# EAGLE design Gyro_revb (EAGLE 7.7.0)
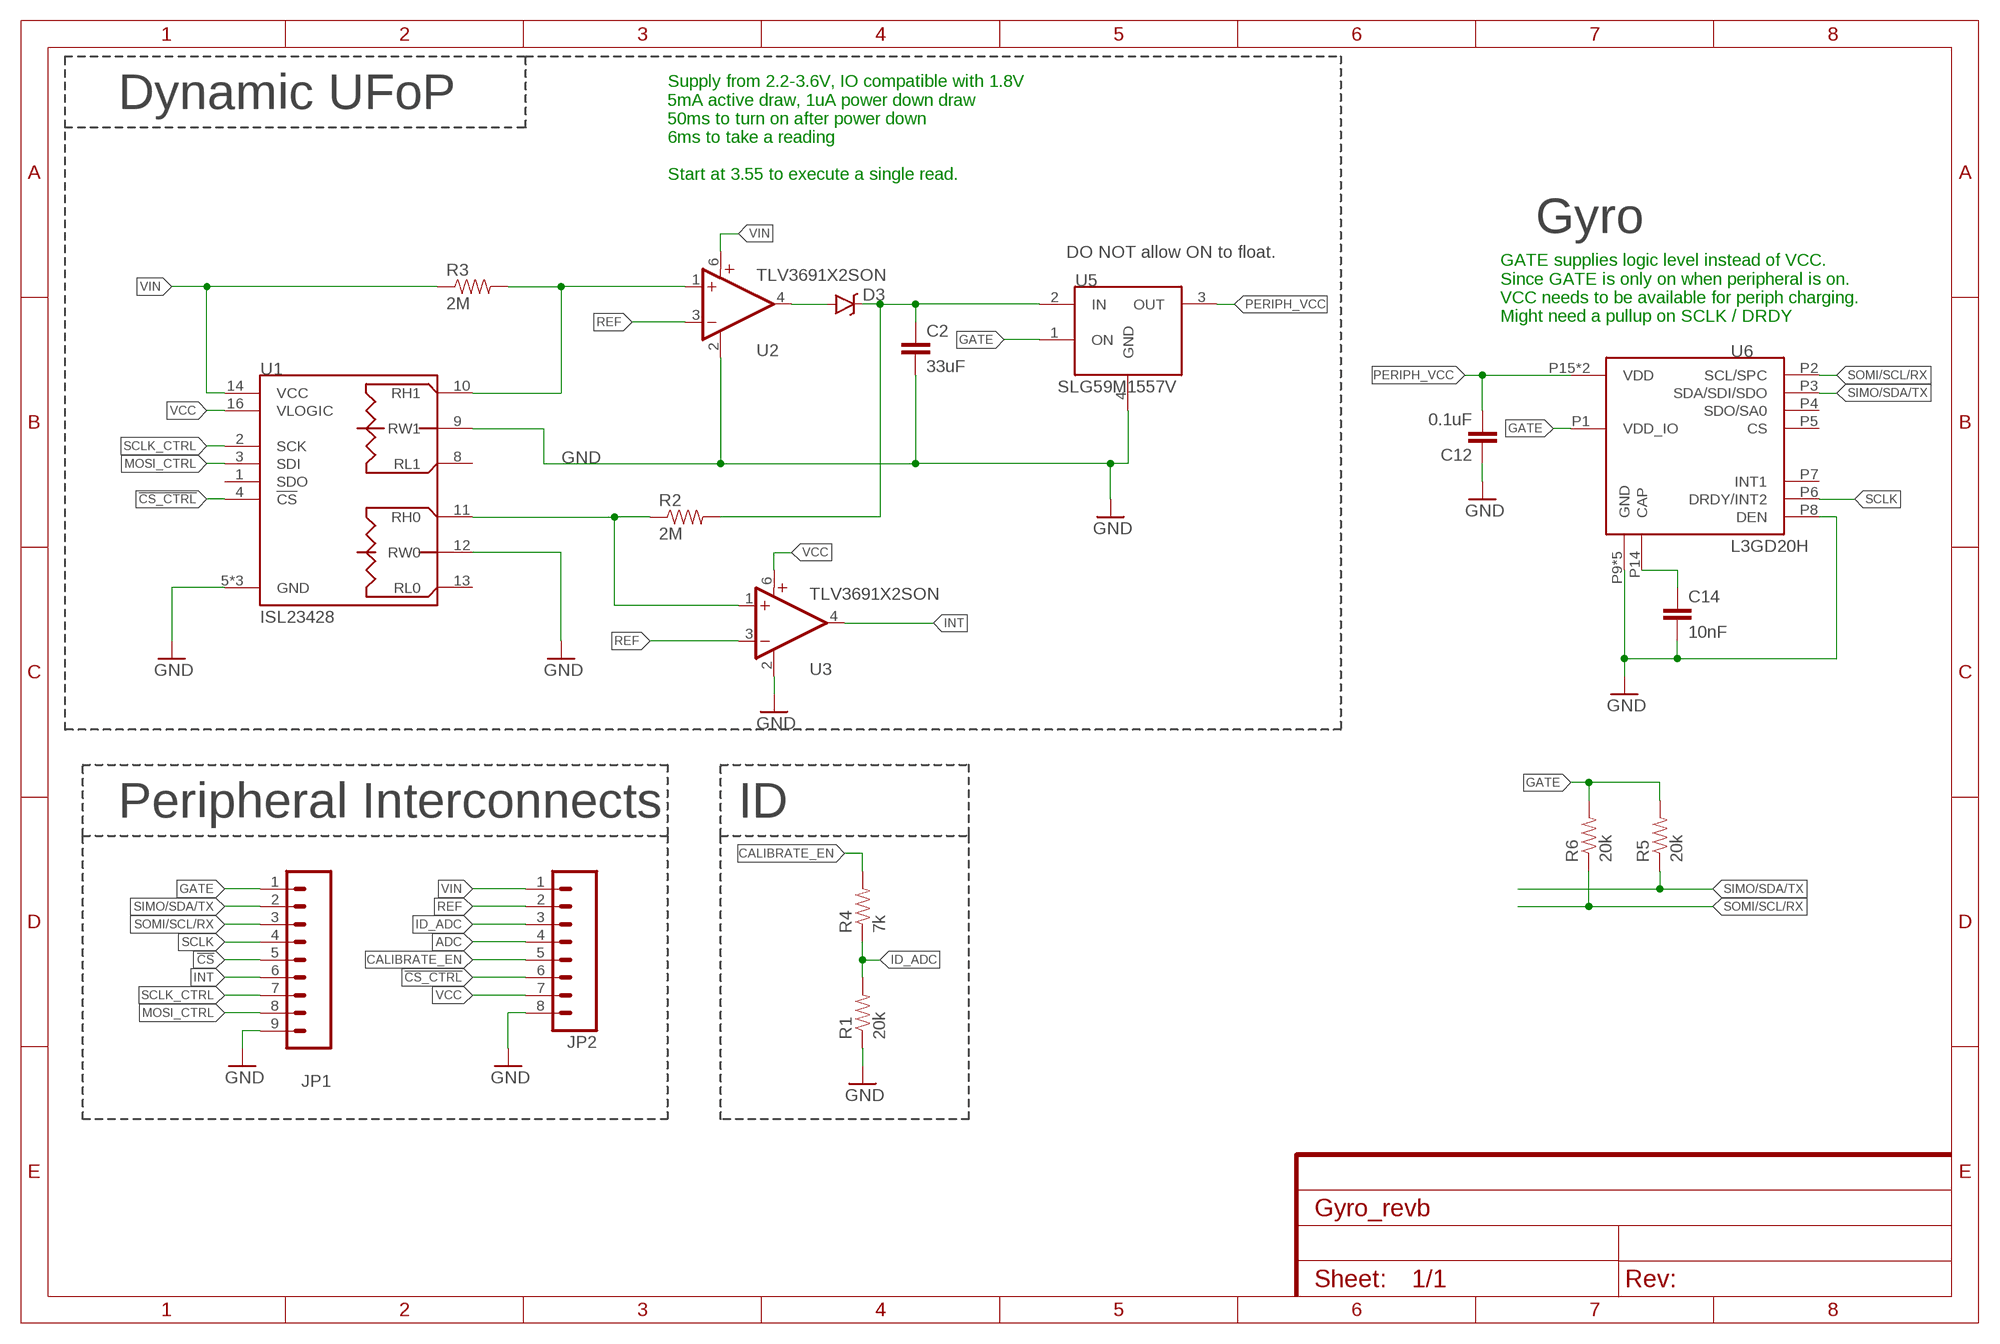
[diagram p0: schematic, sheet 1]
FRAME2 (FRAME-A4L): CNAME: Gyro Peripheral; CREVISION: B; DESIGNER: Josiah Hester

## Parts
C2  33uF  CAP1206  [1206]
C12  0.1uF  C-EU  [0402]
C14  10nF  C-EU  [0402]
D3  RB751  DIODE-SCHOTTKY-RB751  [SOD-523]
JP1  M091.27MM  [1X09-1.27MM]
JP2  M081.27MM  [1X08-1.27MM]
R1  20k  R-EU  [0402]
R2  2M  R-EU  [0402]
R3  2M  R-EU  [0402]
R4  7k  R-EU  [0402]
R5  20k  R-EU  [0402]
R6  20k  R-EU  [0402]
U1  ISL23428  [UTQFN-16]
U2  TLV3691X2SON  [X2SON]
U3  TLV3691X2SON  [X2SON]
U5  SLG59M1557V  [4STDFN]
U6  L3GD20H  [LGA16L]

## Nets
!CS: JP1.5
!CS_CTRL: JP2.6 U1.4(!CS)
ADC: JP2.4
CALIBRATE_EN: JP2.5 R4.2
GATE: JP1.1 R5.2 R6.2 U5.1(ON) U6.P1(VDD_IO)
GND: C2.2 C12.1 C14.2 JP1.9 JP2.8 R1.1 U1.5(GND) U1.6(GND) U1.9(RW1) U1.12(RW0) U1.15(GND) U2.2(GND) U3.2(GND) U5.4(GND) U6.P8(DEN) U6.P9(GND) U6.P10(GND) U6.P11(GND) U6.P12(GND) U6.P13(GND)
ID_ADC: JP2.3 R1.2 R4.1
INT: JP1.6 U3.4(OUT)
MOSI_CTRL: JP1.8 U1.3(SDI)
N$1: D3.A U2.4(OUT)
N$2: C2.1 D3.C R2.2 U5.2(IN)
N$4: R3.2 U1.10(RH1) U2.1(+IN)
N$5: R2.1 U1.11(RH0) U3.1(+IN)
N$8: C14.1 U6.P14(CAP)
PERIPH_VCC: C12.2 U5.3(OUT) U6.P15(VDD) U6.P16(VDD)
REF: JP2.2 U2.3(-IN) U3.3(-IN)
SCLK: JP1.4 U6.P6(DRDY/INT2)
SCLK_CTRL: JP1.7 U1.2(SCK)
SIMO/SDA/TX: JP1.2 R5.1 U6.P3(SDA/SDI/SDO)
SOMI/SCL/RX: JP1.3 R6.1 U6.P2(SCL/SPC)
VCC: JP2.7 U1.16(VLOGIC) U3.6(V+)
VIN: JP2.1 R3.1 U1.14(VCC) U2.6(V+)
Unconnected: U1.1(SDO) U1.8(RL1) U1.13(RL0) U6.P4(SDO/SA0) U6.P5(CS) U6.P7(INT1)

## Notes on the sheet
- Dynamic UFoP
- Supply from 2.2-3.6V, IO compatible with 1.8V
  5mA active draw, 1uA power down draw
  50ms to turn on after power down
  6ms to take a reading
  
  Start at 3.55 to execute a single read.
- Gyro
- DO NOT allow ON to float.
- GATE supplies logic level instead of VCC.
  Since GATE is only on when peripheral is on.
  VCC needs to be available for periph charging.
  Might need a pullup on SCLK / DRDY
- Peripheral Interconnects | ID

## Library data of the parts
C2 = SparkFun-Capacitors:CAP: Capacitor Standard 0603 ceramic capacitor, and 0.1" leaded capacitor.; DIGIKEY: 445-4060-1-ND; MPN: C3216X5R0J336M130AC
C12 = tiny_passives:C-EU; MANAFACTURERPARTNUMBER: 0402YD104KAT2A; MPN: 0402YD104KAT2A
C14 = tiny_passives:C-EU; MPN: 0402YC103KAT2A
D3 = SparkFun-DiscreteSemi:DIODE-SCHOTTKY: Schottky diodes in SFE's production catalog BAT20J 1A 23V 0.62Vf RB751 120mA 40V 0.37Vf PMEG4005EJ 0.5A 40V 0.42Vf MBRA140 1A 40V 0.5Vf B340A 3A 40V SMA; DIGIKEY: BAS40-02V-V-G-08GICT-ND; MPN: BAS40-02V-V-G-08; PROD_ID: DIO-11018
JP1 = SparkFun-Connectors:M09: Header 9 Standard 9-pin 0.1" header. Use with straight break away headers (SKU : PRT-00116), right angle break away headers (PRT-00553), swiss pins (PRT-00743), machine pins (PRT-00117), and female headers (PRT-00115).; DIGIKEY: S9014E-09-ND; MANUFACTURERPARTNUMBER: GRPB091VWVN-RC; MPN: GRPB091VWVN-RC
JP2 = SparkFun-Connectors:M08: Header 8 Standard 8-pin 0.1" header. Use with straight break away headers (SKU : PRT-00116), right angle break away headers (PRT-00553), swiss pins (PRT-00743), machine pins (PRT-00117), and female headers (PRT-00115).; DIGIKEY: S9014E-08-ND; MANUFACTURERPARTNUMBER: GRPB081VWVN-RC; MPN: GRPB081VWVN-RC
R1 R5 R6 = tiny_passives:R-EU; MPN: ERJ-2RKF2002X
R2 R3 = tiny_passives:R-EU; DIGIKEY: 1276-4293-1-ND; MPN: RC1005F205CS
R4 = tiny_passives:R-EU; MPN: RC0402FR-077K15L
U1 = isl23428:ISL23428: Intersil: Dual, 128-Tap, Low Voltage Digitally Controlled Potentiometer The ISL23428 is a volatile, low voltage, low noise, low power, 128-tap, dual digitally controlled potentiometer (DCP) with an SPI Bus™ interface. It integrates two DCP cores, wiper switches and control logic on a monolithic CMOS integrated circuit. Each digitally controlled potentiometer is implemented with a combination of resistor elements and CMOS switches. The position of the wipers are controlled by the user through the SPI bus interface. Each potentiometer has an associated volatile Wiper Register (WRi, i = 0, 1) that can be directly written to and read by the user. The contents of the WRi controls the position of the wiper. When powered on, the wiper of each DCP will always commence at mid-scale (64 tap position). The low voltage, low power consumption, and small package of the ISL23428 make it an ideal choice for use in battery operated equipment. In addition, the ISL23428 has a VLOGIC pin allowing down to 1.2V bus operation, independent from the VCC value. This allows for low logic levels to be connected directly to the ISL23428 without passing through a voltage level shifter. The DCP can be used as a three-terminal potentiometer or as a two-terminal variable resistor in a wide variety of applications including control, parameter adjustments, and signal processing; DIGIKEY: ISL23428TFRUZ-T7ACT-ND; MPN: ISL23428TFRUZ-T7A
U2 U3 = tlv3691:TLV3691: 0.9-V to 6.5-V, Nanopower Comparator Datasheets Analog Signal Chain Guide <http://www.ti.com/lit/pdf/slyb174> TLV3691 <http://www.ti.com/lit/ds/symlink/tlv3691.pdf> Manufacturer Product Page TLV3691IDPFR Specifications <http://www.ti.com/general/docs/suppproductinfo.tsp?distId=10&orderablePartNumber=TLV3691IDPFR> Standard Package <javascript:dlgHelp('Standard%20Packaging%20Help');> 1 Category Integrated Circuits (ICs) </product-search/en/integrated-circuits-ics> Family Linear - Comparators </product-search/en/integrated-circuits-ics/linear-comparators/2556221> Series - Packaging <javascript:dlgHelp('Standard%20Packaging%20Help');> Cut Tape (CT) <javascript:dlgHelp('Cut%20Tape%20Help');> Type General Purpose Number of Elements 1 Output Type Push-Pull Voltage - Supply, Single/Dual (±) 0.9 V ~ 6.5 V, ±0.45 V ~ 3.25 V Voltage - Input Offset (Max) 3mV Current - Input Bias (Max) 100pA Current - Output (Typ) 42mA Current - Quiescent (Max) 150nA CMRR, PSRR (Typ) - Propagation Delay (Max) 35µs Hysteresis - Operating Temperature -40°C ~ 125°C Package / Case 6-XFDFN Mounting Type Surface Mount Supplier Device Package 6-X2SON (1x1) Online Catalog Comparators - 1 element </catalog/en/partgroup/comparators-1-element/3112?mpart=TLV3691IDPFR&vendor=296&WT.z_ref_page_type=PS&WT.z_ref_page_sub_type=PD&WT.z_ref_page_id=PD&WT.z_ref_page_event=DC_Link_Table> Other Names 296-37242-1; DIGIKEY: 296-37242-1-ND; MPN: TLV3691IDPFR
U5 = loadswitches:SLG59M1557V: SILEGO SLG59M1557V: Ultra-small 28.5 mΩ, 1.0 A Integrated Power Switch with Discharge The SLG59M1557V is designed for load switching applications with ultra low quiescent current (20nA), and low turn on voltage (0.85V). The part comes with one 28.5 mΩ 1.0 A rated P-channel MOSFET controlled by a single ON control pin. The product is packaged in an ultra-small 1.0 x 1.0 mm package.; MOUSER: 402-SLG59M1557V; MPN: SLG59M1557V
U6 = l3gd20h:L3GD20H: L3GD20H: MEMS motion sensor: three-axis digital output gyroscope The L3GD20H is a low-power three-axis angular rate sensor. It includes a sensing element and an IC interface able to provide the measured angular rate to the external world through digital interface (I2C/SPI). The sensing element is manufactured using a dedicated micromachining process developed by ST to produce inertial sensors and actuators on silicon wafers. The IC interface is manufactured using a CMOS process that allows a high level of integration to design a dedicated circuit which is trimmed to better match the sensing element characteristics. The L3GD20H has a full scale of ±245/±500/±2000 dps and is capable of measuring rates with a user selectable bandwidth. The L3GD20H is available in a plastic land grid array (LGA) package and can operate within a temperature range from -40 °C to +85 °C.; DIGIKEY: 497-13931-1-ND; MPN: L3GD20HTR

## Board
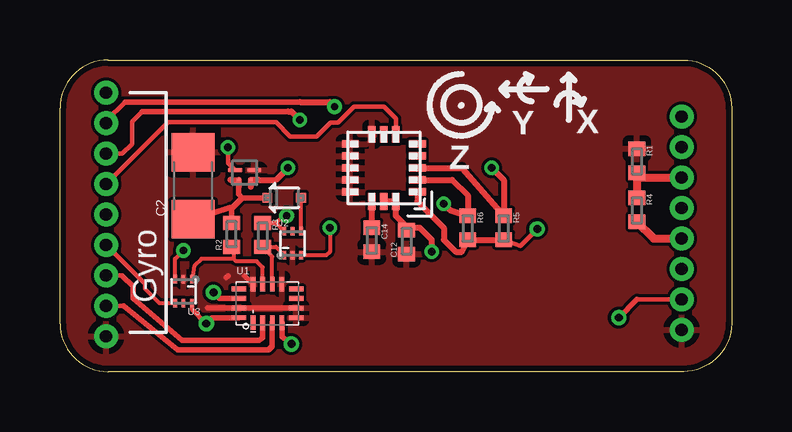
[diagram p1: board, top side]
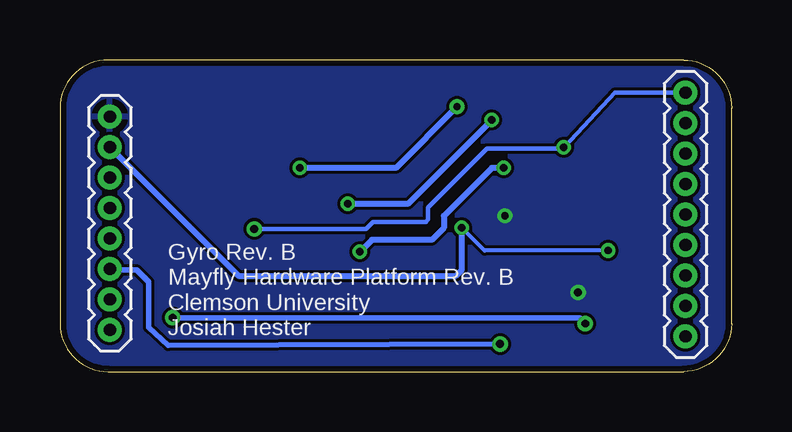
[diagram p2: board, bottom side, seen from below]

Size 28 x 13 mm. Coordinates in mm from the lower left corner, seen from the top.
Outline: 2,13 26,13 arc-90 28,11 28,2 arc-90 26,0 2,0 arc-90 0,2 0,11 arc-90 2,13
Copper layers (1*16): Top 0.035mm / dielectric 1.5mm / Bottom 0.035mm
Design rules "MF_Standard_2_Layer": minimum track width 5mil, minimum drill 12mil, track to track 5mil, track to pad 5mil, pad to pad 5mil, via to via 5mil, smd to smd 0mil, copper to edge 10mil, drill to drill 10mil, minimum pad ring 6mil, minimum via ring 6mil, stop-mask expansion 2mil, vias tented up to drill 25mil, thermal gap 10mil

### Footprints (pad centres in the part's own frame; a part is rotated, then mirrored left to right if it is on the bottom)
1206 = smd 1.6 x 1.8: 1 -1.4,0; 2 1.4,0
0402 = smd 0.6 x 0.7: 1 -0.5,0; 2 0.5,0
SOD-523 = smd 0.4 x 0.4: A -0.7,0; C 0.7,0
1X09-1.27MM = drill 0.508 pad 1: 1 0,0; 2 1.27,0; 3 2.54,0; 4 3.81,0; 5 5.08,0; 6 6.35,0; 7 7.62,0; 8 8.89,0; 9 10.16,0
1X08-1.27MM = drill 0.508 pad 1: 1 0,0; 2 1.27,0; 3 2.54,0; 4 3.81,0; 5 5.08,0; 6 6.35,0; 7 7.62,0; 8 8.89,0
UTQFN-16 = smd 0.2 x 0.6: 1 -0.6,-0.8; 2 -0.2,-0.8; 3 0.2,-0.8; 4 0.6,-0.8; 9 0.6,0.8; 10 0.2,0.8; 11 -0.2,0.8; 12 -0.6,0.8 | smd 0.6 x 0.2: 5 1.2,-0.6; 6 1.2,-0.2; 7 1.2,0.2; 8 1.2,0.6; 13 -1.2,0.6; 14 -1.2,0.2; 15 -1.2,-0.2; 16 -1.2,-0.6
X2SON = smd 0.152 x 0.35: 1 -0.35,-0.5; 2 0,-0.5; 3 0.35,-0.5; 4 0.35,0.5; 5 0,0.5; 6 -0.35,0.5
4STDFN = smd 0.6 x 0.2: 1 -0.4,0.1; 4 0.4,0.1 | smd 0.152 x 0.152: 2 -0.25,-0.3; 3 0.25,-0.3
LGA16L = smd 0.7 x 0.3: P1 -1.4,1; P2 -1.4,0.5; P3 -1.4,0; P4 -1.4,-0.5; P5 -1.4,-1; P9 1.4,-1; P10 1.4,-0.5; P11 1.4,0; P12 1.4,0.5; P13 1.4,1 | smd 0.3 x 0.7: P6 -0.5,-1.4; P7 0,-1.4; P8 0.5,-1.4; P14 0.5,1.4; P15 0,1.4; P16 -0.5,1.4

### Placement (x,y rotation side)
C2  5.55,7.75 90 top
C12  14.45,5.4 90 top
C14  13,5.5 270 top
D3  9.35,7.25 180 top
JP1  1.92,11.63 270 bottom
JP2  25.92,10.63 270 bottom
R1  24.05,8.8 270 top
R2  7.15,5.7 90 top
R3  8.45,5.7 270 top
R4  24.05,6.75 270 top
R5  18.5,6 270 top
R6  17,6 270 top
U1  8.65,2.85 0 top
U2  9.7,5.35 0 top
U3  5.15,3.35 180 top
U5  7.7,8.3 0 top
U6  13.5,8.5 180 top

### Tracks (layer width: path | path; a pad name or v marks a point on that pad's centre or on a via)
!CS_CTRL  (via drill 0.33)
  Top 0.222: U1.4 9.25,1.45 v9.65,1.15
  Bottom 0.19: 25.89,4.25 JP2.6
  Bottom 0.222: v9.65,1.15 23.5,1.1 24.3,1.85 24.3,3.75 24.8,4.25 25.89,4.25
CALIBRATE_EN
  Top 0.33: R4.2 24.75,5.55 JP2.5
GATE  (via drill 0.3, 0.33)
  Top 0.19: v19.9,5.95 19.2,5.25 R5.2 | U5.1 7,8.7 v7,9.35
  Top 0.222: U6.P1 14.9,7.1
  Top 0.25: 14.9,7.1 16,6 16,5.5 16.5,5 16.75,5 R6.2 R5.2
  Bottom 0.16: 4.87,11.63 v7,9.35
  Bottom 0.19: v7,9.35 7.05,9.3 10.2,9.3 12.65,6.85 12.65,6.35 12.75,6.25 14.95,6.25 15.25,5.95 v19.9,5.95 | 4.87,11.63 JP1.1
GND
  Top 0.222: U1.6 U1.15 6.15,2.65 | U1.12 7.7,4 | 7,4 6.92,3.92
  pour Top: -0.5,0 28.5,0 28.5,13.5 -0.5,13.5
ID_ADC
  Top 0.33: R4.1 R1.2 24.26,8.09 JP2.3
INT
  Top 0.16: U3.4 4.15,2.85 3.55,3.45 3.55,3.65
  Top 0.19: 3.55,3.65 JP1.6
MOSI_CTRL
  Top 0.19: 2.66,2.74 JP1.8
  Top 0.222: 2.66,2.74 4.9,0.9 8.7,0.9 8.85,1.05 U1.3
N$1
  Top 0.16: U2.4 D3.A
N$2
  Top 0.222: D3.C 7.6,7.25 | 7.6,7.25 7.45,7.4 U5.2 | R2.2 7.15,6.8 | 7.15,6.8 7.6,7.25 | C2.1 7.1,6.85 7.15,6.8
N$4
  Top 0.16: U2.1 9,5.2 R3.2 8.85,4.8 U1.10
N$5
  Top 0.16: U1.11 8.45,4.35 8.2,4.6 7.35,4.6 7.25,4.7 | 7.25,4.7 7.25,5.1 R2.1 | 7.25,4.7 5.9,4.7 5.6,4.4 U3.1
N$8
  Top 0.25: C14.1 U6.P14
PERIPH_VCC  (via drill 0.3)
  Top 0.25: U6.P15 U6.P16 14,6.5 14.45,6.05 C12.2 14.55,6 15,6 15.5,5.5 v15.5,5 | 8.3,8 9,8 v9.5,8.5
  Bottom 0.25: v9.5,8.5 10,8.5 12,6.5 12,6 12.5,5.5 15,5.5 v15.5,5
REF  (via drill 0.3)
  Top 0.16: v11.25,6 11.25,5 11.1,4.85 U2.3 | U3.3 4.8,4.7 v5.15,5.05
  Bottom 0.16: v5.15,5.05 10.3,5.05 v11.25,6
  Bottom 0.222: 22.56,6 JP2.2
  Bottom 0.25: 22.56,6 20.56,4 11.5,4 11.25,4.25 v11.25,6
SCLK
  Top 0.19: U6.P6 14,10.55 13.5,11.05 12.26,11.05 11.6,10.39 11.29,10.39 10.7,9.8 9.6,9.8 9,10.4 4.5,10.4 JP1.4
SCLK_CTRL
  Top 0.19: 2.6,4 2.59,4.01 JP1.7
  Top 0.222: 2.6,4 3.05,3.55 3.05,3.05 5.1,1.3 8.3,1.3 8.45,1.4 U1.2
SIMO/SDA/TX  (via drill 0.3)
  Top 0.19: 2.71,11.25 1.92,10.46 JP1.2
  Top 0.222: 2.71,11.25 10,11.25
  Top 0.25: U6.P3 16.75,8.5 R5.1 18.5,8 v18,8.5 | 10,11.25 11.25,11.25 v11.45,11.05
  Bottom 0.25: v11.45,11.05 14,8.5 v18,8.5
SOMI/SCL/RX  (via drill 0.3)
  Top 0.19: 3.43,10.85 3,10.42 3,9.5 2.59,9.09 JP1.3
  Top 0.222: 3.43,10.85 9.5,10.85
  Top 0.25: U6.P2 16.35,8 17,7.35 R6.1 16.25,6.75 v16,7 | 9.5,10.85 9.65,10.85 v10,10.5
  Bottom 0.25: v10,10.5 13.5,7 v16,7
VCC  (via drill 0.33)
  Top 0.18: U3.6 5.5,2.6 v6.1,2
  Top 0.19: 24.06,3.01 JP2.7
  Top 0.222: 24.06,3.01 v23.3,2.25 | v6.1,2 6.35,2.25 U1.16
  Bottom 0.222: v23.3,2.25 6.35,2.25 v6.1,2
VIN  (via drill 0.3, 0.33)
  Top 0.16: R3.1 9,6.2 | 9,6.2 U2.6 | v9.45,6.5 9.3,6.5 9,6.2
  Top 0.222: U1.14 6.65,3.05 v6.4,3.3
  pour Bottom: 0,0 28.5,0 28.5,13.5 0,13.5

### Text on the board
tPlace: Y | X | Z | Gyro
bPlace: Gyro Rev. B / Mayfly Hardware Platform Rev. B / Clemson University / Josiah Hester